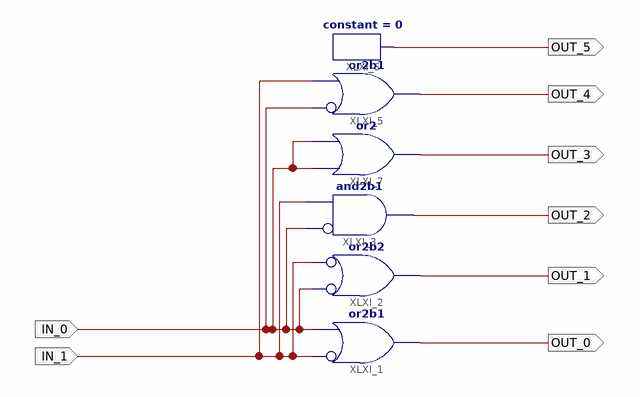
[diagram p0: schematic sheet 1]
// Xilinx ISE schematic My2To6Decoder.sch (spartan3a) as structural Verilog: 6 symbols, 8 ports
module My2To6Decoder (
  input  IN_0,
  input  IN_1,
  output OUT_0,
  output OUT_1,
  output OUT_2,
  output OUT_4,
  output OUT_5,
  output OUT_3
);

  or XLXI_1 (OUT_0, ~IN_1, IN_0);  // or2b1
  or XLXI_2 (OUT_1, ~IN_0, ~IN_1);  // or2b2
  and XLXI_3 (OUT_2, ~IN_0, IN_1);  // and2b1
  or XLXI_5 (OUT_4, ~IN_0, IN_1);  // or2b1
  constant #(.CValue("0")) XLXI_6 (.O(OUT_5));
  or XLXI_7 (OUT_3, IN_0, IN_0);
endmodule
